# Altium project PT2399Delay.PrjPCB
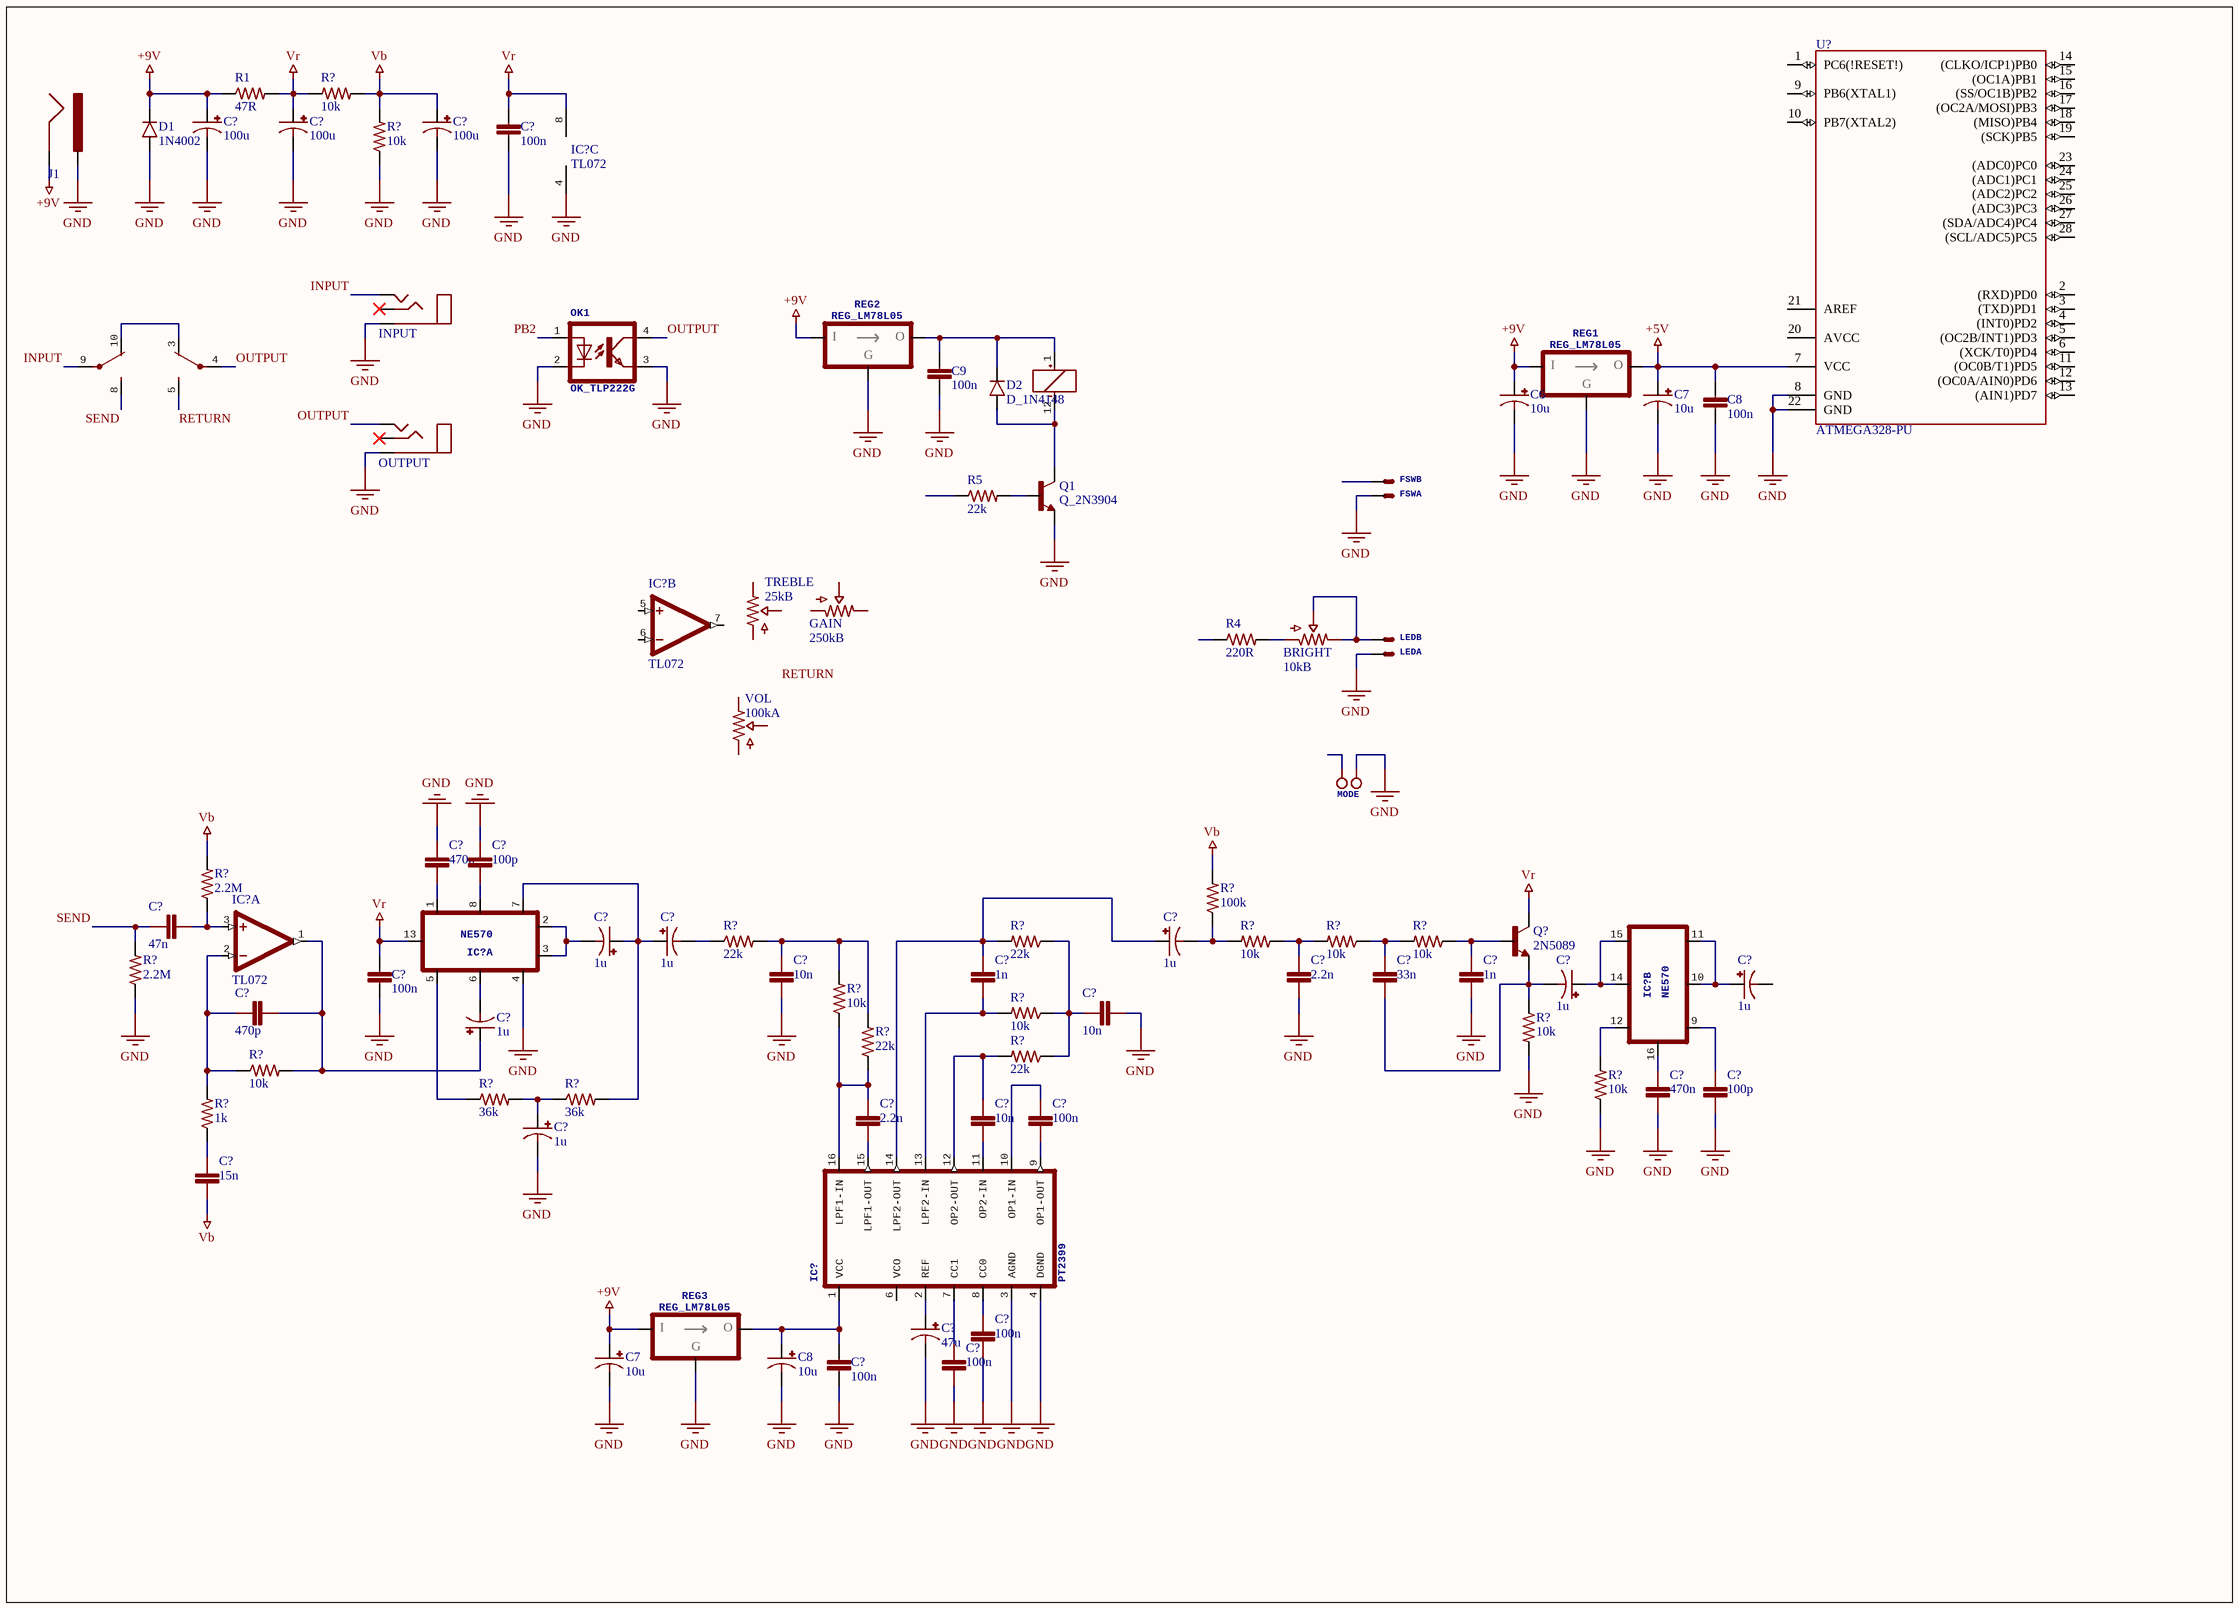
[diagram p0: PT2399Delay.SchDoc]
1 sheet, 87 parts. Net scope: global (net labels, ports and power ports of the same name join across sheets).
Board file: PT2399Delay.PcbDoc

## Sheet PT2399Delay.SchDoc
size A3

### Parts
(Parts that share a designator on the sheet are numbered #1, #2 ... from top to bottom, then left to right.)
BRIGHT  10kB  [BOURNS_3296W]
C6  10u  [ELEC_040_020]
C7#1  10u  [ELEC_040_020]
C7#2  10u  [ELEC_040_020]
C8#1  100n  [CER_050]
C8#2  10u  [ELEC_040_020]
C9  100n  [CER_050]
C?#1  100u  [ELEC_050_020]
C?#2  100u  [ELEC_050_020]
C?#3  100u  [ELEC_050_020]
C?#4  100n  [CER_050]
C?#5  470n  [FILMBOX_MED]
C?#6  100p  [CER_050]
C?#7  47n  [FILMBOX_SMALL]
C?#8  1u  [ELEC_LESR_040_020]
C?#9  1u  [ELEC_LESR_040_020]
C?#10  1u  [ELEC_LESR_040_020]
C?#11  100n  [CER_050]
C?#12  10n  [FILMBOX_SMALL]
C?#13  1n  [FILMBOX_SMALL]
C?#14  2.2n  [FILMBOX_SMALL]
C?#15  33n  [FILMBOX_SMALL]
C?#16  1n  [FILMBOX_SMALL]
C?#17  1u  [ELEC_LESR_040_020]
C?#18  1u  [ELEC_LESR_040_020]
C?#19  470p  [CER_050]
C?#20  10n  [FILMBOX_SMALL]
C?#21  1u  [ELEC_LESR_040_020]
C?#22  470n  [FILMBOX_MED]
C?#23  100p  [CER_050]
C?#24  2.2n  [FILMBOX_SMALL]
C?#25  1u  [ELEC_LESR_040_020]
C?#26  10n  [FILMBOX_SMALL]
C?#27  100n  [FILMBOX_SMALL]
C?#28  15n  [FILMBOX_SMALL]
C?#29  47u  [ELEC_050_020]
C?#30  100n  [FILMBOX_SMALL]
C?#31  100n  [CER_050]
C?#32  100n  [FILMBOX_SMALL]
D1  1N4002  [DO41_2]
D2  D_1N4148  [DO35_2]
FSW  J_JST-XH-02  [JST-XH-02]  (value not drawn)  (parts A,B of 2)
GAIN  250kB  [ALPHA_16mm_BOTTOM]
IC?#1  TL072  [DIL8]  (part C of 3)
IC?#2  TL072  [DIL8]  (part B of 3)
IC?#3  TL072  [DIL8]  (part A of 3)
IC?#4  NE570  [DIL16]  (part A of 2)
IC?#5  NE570  [DIL16]  (part B of 2)
IC?#6  PT2399  [DIL16]
INPUT  J_STEREO  [STEREO]  (value not drawn)
J1  J_DC_JACK  [DC_JACK]  (value not drawn)
K1  K_NA5W-K  [NA5]  (value not drawn)  (parts A,B,C of 3)
LED  J_JST-XH-02  [JST-XH-02]  (value not drawn)  (parts A,B of 2)
MODE  J_HEADER_2PINS  [HEADER_2PINS]  (value not drawn)
OK1  OK_TLP222G  [DIL4]
OUTPUT  J_STEREO  [STEREO]  (value not drawn)
Q1  Q_2N3904  [TO92]
Q?  2N5089  [TO92]
R1  47R  [R_3_47R_025W]
R4  220R  [R_3_220R_025W]
R5  22k  [R_3_22k_025W]
R?#1  10k  [R_3_10k_025W]
R?#2  10k  [R_3_10k_025W]
R?#3  2.2M  [R_3_2,2M_025W]
R?#4  100k  [R_3_100k_025W]
R?#5  22k  [R_3_22k_025W]
R?#6  22k  [R_3_22k_025W]
R?#7  10k  [R_3_10k_025W]
R?#8  10k  [R_3_10k_025W]
R?#9  10k  [R_3_10k_025W]
R?#10  2.2M  [R_3_2,2M_025W]
R?#11  10k  [R_3_10k_025W]
R?#12  10k  [R_3_10k_025W]
R?#13  10k  [R_3_10k_025W]
R?#14  22k  [R_3_22k_025W]
R?#15  22k  [R_3_22k_025W]
R?#16  10k  [R_3_10k_025W]
R?#17  10k  [R_3_10k_025W]
R?#18  36k  [R_3_36k_025W]
R?#19  36k  [R_3_36k_025W]
R?#20  1k  [R_3_1k_025W]
REG1  REG_LM78L05  [TO92]
REG2  REG_LM78L05  [TO92]
REG3  REG_LM78L05  [TO92]
TREBLE  25kB  [ALPHA_16mm_BOTTOM]
U?  ATMEGA328-PU  [*DIL28]
VOL  100kA  [ALPHA_16mm_BOTTOM]

### Nets
+5V: C7#1.+ C8#1.2 REG1.3(VO) U?.7(VCC)
+9V: C6.+ C7#2.+ C?#1.+ D1.C J1.GND R1.1 REG1.1(VI) REG2.1(VI) REG3.1(VI)
GND: C6.- C7#1.- C7#2.- C8#1.1 C8#2.- C9.2 C?#1.- C?#2.- C?#3.- C?#4.2 C?#5.1 C?#6.1 C?#11.1 C?#12.2 C?#14.2 C?#16.2 C?#20.1 C?#22.2 C?#23.2 C?#25.- C?#29.- C?#30.2 C?#31.1 C?#32.2 D1.A FSW.2(S) IC?#1.4(V-) IC?#4.4 IC?#6.3(AGND) IC?#6.4(DGND) INPUT.S J1.PWR LED.2(S) MODE.1 OK1.2(C) OK1.3(EMIT) OUTPUT.S Q1.3(E) R?#2.1 R?#10.1 R?#13.2 R?#17.1 REG1.2(GND) REG2.2(GND) REG3.2(GND) U?.8(GND) U?.22(GND)
Vb: C?#3.+ C?#28.2 R?#1.2 R?#2.2 R?#3.2 R?#4.2
Vr: C?#2.+ C?#4.1 C?#11.2 IC?#1.8(V+) IC?#4.13 Q?.1(C) R1.2 R?#1.1
INPUT: INPUT.T K1.9(P)
OUTPUT: K1.4(P) OK1.4(COL) OUTPUT.T
PB2: OK1.1(A)
RETURN: K1.5(S)
SEND: C?#7.2 K1.8(S) R?#10.2
NetBRIGHT_1: BRIGHT.1 R4.2
NetBRIGHT_2: BRIGHT.2 BRIGHT.3 LED.1(S)
NetC8#2_+: C8#2.+ C?#31.2 IC?#6.1(VCC) REG3.3(VO)
NetC9_1: C9.1 D2.C K1.1(+) REG2.3(VO)
NetC?#5_2: C?#5.2 IC?#4.1
NetC?#6_2: C?#6.2 IC?#4.8
NetC?#7_1: C?#7.1 IC?#3.3(+IN) R?#3.1
NetC?#8_+: C?#8.+ C?#9.+ IC?#4.7 R?#19.2
NetC?#8_-: C?#8.- IC?#4.2 IC?#4.3
NetC?#9_-: C?#9.- R?#5.1
NetC?#10_+: C?#10.+ C?#13.1 IC?#6.14(LPF2-OUT) R?#6.2
NetC?#10_-: C?#10.- R?#4.1 R?#7.2
NetC?#12_1: C?#12.1 R?#5.2 R?#11.2 R?#14.2
NetC?#13_2: C?#13.2 IC?#6.13(LPF2-IN) R?#12.2
NetC?#14_1: C?#14.1 R?#7.1 R?#8.2
NetC?#15_1: C?#15.1 R?#8.1 R?#9.2
NetC?#15_2: C?#15.2 C?#17.- Q?.3(E) R?#13.1
NetC?#16_1: C?#16.1 Q?.2(B) R?#9.1
NetC?#17_+: C?#17.+ IC?#5.14 IC?#5.15
NetC?#18_+: C?#18.+ IC?#5.10 IC?#5.11
NetC?#19_1: C?#19.1 C?#21.+ IC?#3.1(OUT) R?#16.2
NetC?#19_2: C?#19.2 IC?#3.2(-IN) R?#16.1 R?#20.2
NetC?#20_2: C?#20.2 R?#6.1 R?#12.1 R?#15.1
NetC?#21_-: C?#21.- IC?#4.6
NetC?#22_1: C?#22.1 IC?#5.16
NetC?#23_1: C?#23.1 IC?#5.9
NetC?#24_1: C?#24.1 IC?#6.15(LPF1-OUT)
NetC?#24_2: C?#24.2 IC?#6.16(LPF1-IN) R?#11.1 R?#14.1
NetC?#25_+: C?#25.+ R?#18.2 R?#19.1
NetC?#26_1: C?#26.1 IC?#6.12(OP2-OUT) R?#15.2
NetC?#26_2: C?#26.2 IC?#6.11(OP2-IN)
NetC?#27_1: C?#27.1 IC?#6.10(OP1-IN)
NetC?#27_2: C?#27.2 IC?#6.9(OP1-OUT)
NetC?#28_1: C?#28.1 R?#20.1
NetC?#29_+: C?#29.+ IC?#6.2(REF)
NetC?#30_1: C?#30.1 IC?#6.8(CC0)
NetC?#32_1: C?#32.1 IC?#6.7(CC1)
NetD2_A: D2.A K1.12(-) Q1.1(C)
NetIC?#4_5: IC?#4.5 R?#18.1
NetIC?#5_12: IC?#5.12 R?#17.2
NetK1_3: K1.3(O) K1.10(O)
NetQ1_2: Q1.2(B) R5.2

Not connected (* = marked no-connect by the designer): C?#18 -; FSW 1(S); GAIN 1 2 3; IC?#2 5(+IN) 6(-IN) 7(OUT); IC?#6 6(VCO); INPUT R*; MODE 2; OUTPUT R*; R4 1; R5 1; TREBLE 1 2 3; U? 1(PC6(!RESET!)) 2((RXD)PD0) 3((TXD)PD1) 4((INT0)PD2) 5((OC2B/INT1)PD3) 6((XCK/T0)PD4) 9(PB6(XTAL1)) 10(PB7(XTAL2)) 11((OC0B/T1)PD5) 12((OC0A/AIN0)PD6) 13((AIN1)PD7) 14((CLKO/ICP1)PB0) 15((OC1A)PB1) 16((SS/OC1B)PB2) 17((OC2A/MOSI)PB3) 18((MISO)PB4) 19((SCK)PB5) 20(AVCC) 21(AREF) 23((ADC0)PC0) 24((ADC1)PC1) 25((ADC2)PC2) 26((ADC3)PC3) 27((SDA/ADC4)PC4) 28((SCL/ADC5)PC5); VOL 1 2 3

### Notes on the sheet
- Labels drawn without touching a wire or pin: RETURN
- Title
- Size:
- Date:
- A3
- Number:
- Time:
- Revision:
- Sheet
- of
- File:
- (in symbol REG_LM78L05) I; O; G

### Library data of the parts
BRIGHT = POT_10kB_TRIM_3296W: 10k Lin 3296W trimmer; Price: 0.1
C6 C7#1 C7#2 C8#2 = C_ELEC_10u_50V: 10u 50V electrolytic capacitor; PinSpacing: 2mm; Dimensions: 4x8mm; Package: Radial; Price: 0.02
C8#1 C9 C?#4 C?#11 C?#31 = C_CER_100n: 100n MLCC X7R radial capacitor; PinSpacing: 5.08mm; Package: Radial; Price: 0.02
C?#1-C?#3 = C_ELEC_100u_16V: 100u 16V electrolytic capacitor; PinSpacing: 2mm; Price: 0.02; Dimensions: 5x8mm; Package: Radial
C?#5 C?#22 = C_FILMBOX_470n: 470n 100V polyester film box capacitor; PinSpacing: 5.08mm; Price: 0.05; Dimensions: 7.2x4.5x9.5mm; Package: Radial
C?#6 C?#23 = C_CER_100p: 100p MLCC X7R radial capacitor; PinSpacing: 5.08mm; Price: 0.01; Package: Radial
C?#7 = C_FILMBOX_47n: 47n 100V polyester film box capacitor; PinSpacing: 5.08mm; Price: 0.05; Dimensions: 7.2x2.5x6.5mm; Package: Radial
C?#8-C?#10 C?#17 C?#18 C?#21 C?#25 = C_ELEC_LESR_1u_50V: 1u 50V Low ESR electrolytic capacitor; PinSpacing: 2mm; Price: 0.05; Dimensions: 4x8mm; Package: Radial
C?#12 C?#20 C?#26 = C_FILMBOX_10n: 10n 100V polyester film box capacitor; PinSpacing: 5.08mm; Price: 0.05; Dimensions: 7.2x2.5x6.5mm; Package: Radial
C?#13 C?#16 = C_FILMBOX_1n: 1n 100V polyester film box capacitor; PinSpacing: 5.08mm; Price: 0.05; Dimensions: 7.2x2.5x6.5mm; Package: Radial
C?#14 C?#24 = C_FILMBOX_2.2n: 2.2n 100V polyester film box capacitor; PinSpacing: 5.08mm; Price: 0.05; Dimensions: 7.2x2.5x6.5mm; Package: Radial
C?#15 = C_FILMBOX_33n: 33n 100V polyester film box capacitor; PinSpacing: 5.08mm; Price: 0.05; Dimensions: 7.2x2.5x6.5mm; Package: Radial
C?#19 = C_CER_470p: 470p MLCC X7R radial capacitor; PinSpacing: 5.08mm; Price: 0.01; Package: Radial
C?#27 C?#30 C?#32 = C_FILMBOX_100n: 100n 100V polyester film box capacitor; PinSpacing: 5.08mm; Price: 0.05; Dimensions: 7.2x2.5x6.5mm; Package: Radial
C?#28 = C_FILMBOX_15n: 15n 100V polyester film box capacitor; PinSpacing: 5.08mm; Price: 0.05; Dimensions: 7.2x2.5x6.5mm; Package: Radial
C?#29 = C_ELEC_47u_25V: 47u 25V electrolytic capacitor; PinSpacing: 2mm; Price: 0.02; Dimensions: 5x8mm; Package: Radial
D1 = D_1N4002: PinSpacing: 7.62mm; Package: DO-41; Price: 0.01
D2 = D_1N4148: 1N4148; PinSpacing: 5.08mm; Price: 0.01; Package: DO-35
FSW LED = J_JST-XH-02: 2 Pins male XH header; Price: 0.1
GAIN = POT_250kB_ALPHA_16mm: 250k Lin potentiometer round shaft; Price: 0.5; Dimensions: 16mm; Package: PCB Mounted
IC?#1-IC?#3 = IC_TL072: Price: 0.1; Package: DIP-8
IC?#4 IC?#5 = IC_NE570
IC?#6 = IC_PT2399
INPUT OUTPUT = J_STEREO: 6.35mm stereo insulated socket jack PCB mounted; Price: 0.5
J1 = J_DC_JACK: DC Power jack 2.1mm barrel; Price: 0.05
K1 = K_NA5W-K: NA5W-K; Price: 1.1
MODE = J_HEADER_2PINS: 2 Pins male header; Pin spacing: 2.54mm; Price: 0.01
OK1 = OK_TLP222G: TLP222G; Price: 0.36
Q1 = Q_2N3904: 2N3904; Package: TO-92; Price: 0.01
Q? = Q_2N5089: Price: 0.02; Package: TO-92
R1 = R_3_47R_025W: 47R metal film 1/4W Resistor; PinSpacing: 7.62mm; Price: 0.01
R4 = R_3_220R_025W: 220R metal film 1/4W Resistor; PinSpacing: 7.62mm; Price: 0.01
R5 R?#5 R?#6 R?#14 R?#15 = R_3_22k_025W: 22k metal film 1/4W Resistor; PinSpacing: 7.62mm; Price: 0.01
R?#1 R?#2 R?#7-R?#9 R?#11-R?#13 R?#16 R?#17 = R_3_10k_025W: 10k metal film 1/4W Resistor; PinSpacing: 7.62mm; Price: 0.01
R?#3 R?#10 = R_3_2.2M_025W: 2.2M metal film 1/4W Resistor; PinSpacing: 7.62mm; Price: 0.01
R?#4 = R_3_100k_025W: 100k metal film 1/4W Resistor; PinSpacing: 7.62mm; Price: 0.01
R?#18 R?#19 = R_3_36k_025W: 36k metal film 1/4W Resistor; PinSpacing: 7.62mm; Price: 0.01
R?#20 = R_3_1k_025W: 1k metal film 1/4W Resistor; PinSpacing: 7.62mm; Price: 0.01
REG1-REG3 = REG_LM78L05: 78L05; Package: TO-92; Price: 0.01
TREBLE = POT_25kB_ALPHA_16mm: 25k Lin potentiometer round shaft; Price: 0.5; Dimensions: 16mm; Package: PCB Mounted
U? = U_ATMEGA328-PU: ATMEGA328; MF: Microchip; SnapEDA_Link: https://www.snapeda.com/parts/ATMEGA328-PU/Microchip/view-part/?ref=snap; MP: ATMEGA328-PU; Availability: Unavailable; Package: PDIP-28 Microchip; Price: None; Value: *
VOL = POT_100kA_ALPHA_16mm: 100k Log potentiometer round shaft; Price: 0.5; Dimensions: 16mm; Package: PCB Mounted